# Altium schematic sheet Sample_FPC_v1.SchDoc
size A3; SheetNumber: 3; SheetTotal: 5
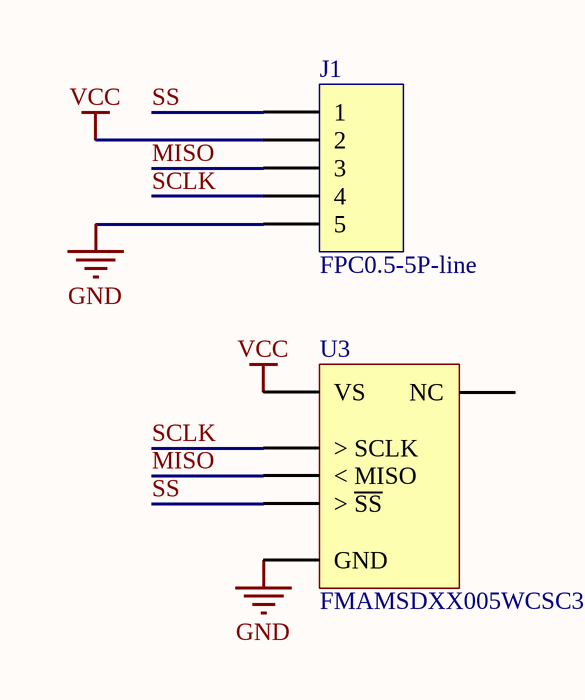
[diagram p0: Sample_FPC_v1.SchDoc]

## Parts
J1  FPC0.5-5P-line  [FPC0.5-5P-Line]
U3  FMAMSDXX005WCSC3  [FMA_MICROFORCE_6]

## Nets
GND: J1.5 U3.3(GND)
VCC: J1.2 U3.1(VS)
MISO: J1.3 U3.5(<_MISO)
SCLK: J1.4 U3.4(>_SCLK)
SS: J1.1 U3.2(>_~{SS})

Not connected (* = marked no-connect by the designer): U3 6(NC)

## Library data of the parts
U3 = FMAMSDXX005WCSC3: Force Range: 5N / Output: SPI / FMA Series Force Sensor, compensated/amplified, mechanically / coupled, sphere contact element, sensor short and open / diagnostics, 5 N force range, compression force type, SPI digital / output, 20% to 80% transfer function, 3.3 V ±10% supply voltage